# EAGLE design OMNIBUS GRBL board v2 (EAGLE 9.3.1)
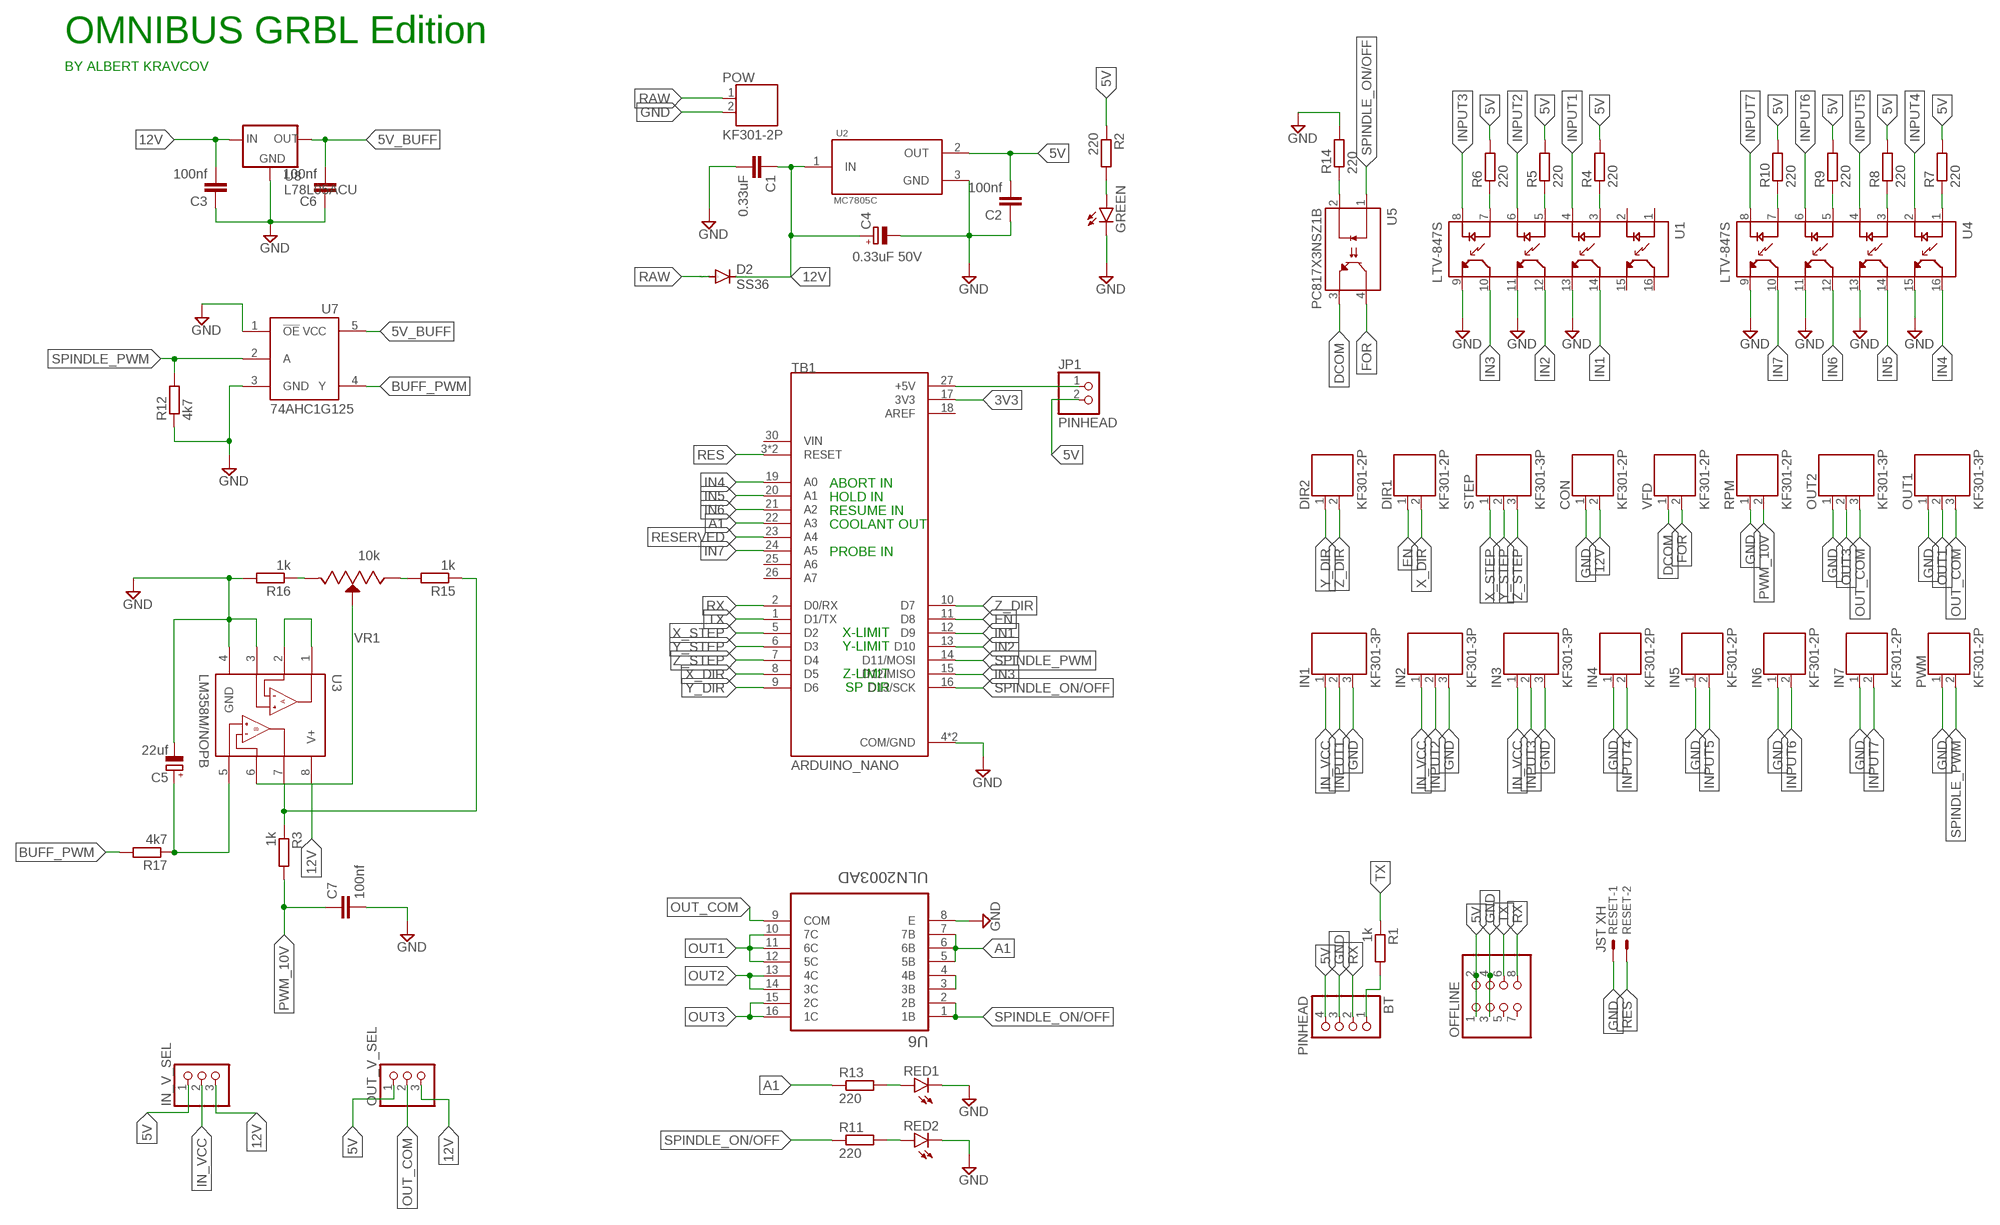
[diagram p0: schematic, sheet 1]

## Parts
BT  PINHEAD  PINHD-1X4  [1X04]
C1  0.33uF  C-EUC1206K  [C1206K]
C2  100nf  C-EUC0805K  [C0805K]
C3  100nf  C-EUC0805  [C0805]
C4  0.33uF 50V  CPOL-EUE2-5  [E2-5]
C5  22uf  CPOL-EUE2-5  [E2-5]
C6  100nf  C-EUC0805  [C0805]
C7  100nf  C-EUC0805  [C0805]
CON  KF301-2P  691131710002  [691131710002]
D2  SS36  ES2D  [SMB]
DIR1  KF301-2P  691131710002  [691131710002]
DIR2  KF301-2P  691131710002  [691131710002]
GREEN  LEDCHIPLED_0805  [CHIPLED_0805]
IN1  KF301-3P  691131710003  [691131710003]
IN2  KF301-3P  691131710003  [691131710003]
IN3  KF301-3P  691131710003  [691131710003]
IN4  KF301-2P  691131710002  [691131710002]
IN5  KF301-2P  691131710002  [691131710002]
IN6  KF301-2P  691131710002  [691131710002]
IN7  KF301-2P  691131710002  [691131710002]
IN_V_SEL  PINHD-1X3  [1X03]
JP1  PINHEAD  PINHD-1X2  [1X02]
OFFLINE  PINHD-2X4  [2X04]
OUT1  KF301-3P  691131710003  [691131710003]
OUT2  KF301-3P  691131710003  [691131710003]
OUT_V_SEL  PINHD-1X3  [1X03]
POW  KF301-2P  691131710002  [691131710002]
PWM  KF301-2P  691131710002  [691131710002]
R1  1k  R-EU_R0805  [R0805]
R2  220  R-EU_R0603  [R0603]
R3  1k  R-EU_R0805  [R0805]
R4  220  R-EU_R0805  [R0805]
R5  220  R-EU_R0805  [R0805]
R6  220  R-EU_R0805  [R0805]
R7  220  R-EU_R0805  [R0805]
R8  220  R-EU_R0805  [R0805]
R9  220  R-EU_R0805  [R0805]
R10  220  R-EU_R0805  [R0805]
R11  220  R-EU_R0603  [R0603]
R12  4k7  R-EU_R0805  [R0805]
R13  220  R-EU_R0603  [R0603]
R14  220  R-EU_R0805  [R0805]
R15  1k  R-EU_R0805  [R0805]
R16  1k  R-EU_R0805  [R0805]
R17  4k7  R-EU_R0805  [R0805]
RED1  LEDCHIPLED_0805  [CHIPLED_0805]
RED2  LEDCHIPLED_0805  [CHIPLED_0805]
RESET  JST XH  22-23-2021  [22-23-2021]
RPM  KF301-2P  691131710002  [691131710002]
STEP  KF301-3P  691131710003  [691131710003]
TB1  ARDUINO_NANO  [SHIELD_ARDUINO_NANO]
U1  LTV-847S  [SOIC254P1016X460-16N]
U2  MC7805C  L7805ACD2T-TR  [TO254P1515X470-3N]
U3  LM358M/NOPB  [SOIC127P599X175-8N]
U4  LTV-847S  [SOIC254P1016X460-16N]
U5  PC817X3NSZ1B  [DIP762W50P254L495H455Q4]
U6  ULN2003AD  [SOIC127P600X175-16N]
U7  74AHC1G125  [SOT23-5L]
U8  L78L05ACU  [SOT89]
VFD  KF301-2P  691131710002  [691131710002]
VR1  10k  3296W-1-502  [TRIM_3296W-1-502]

## Nets
3V3 [power]: TB1.17(3V3)
5V [power]: BT.4 C2.2 IN_V_SEL.1 JP1.2 OFFLINE.1 OFFLINE.2 OUT_V_SEL.1 R2.1 R4.2 R5.2 R6.2 R7.2 R8.2 R9.2 R10.2 U2.2(OUT)
5V_BUFF: C6.2 U7.5(VCC) U8.1(OUT)
12V [power]: C1.1 C3.2 C4.+ CON.2 D2.C IN_V_SEL.3 OUT_V_SEL.3 U2.1(IN) U3.8(V+) U8.3(IN)
A1 [sign]: R13.1 TB1.22(A3) U6.5(5B) U6.6(6B) U6.7(7B)
A2: U6.3(3B) U6.4(4B)
ARDUPWR [power]: JP1.1 TB1.27(+5V)
BUFF_PWM [sign]: R17.2 U7.4(Y)
DCOM [power]: U5.3(EMITTER) VFD.1
EN [power]: DIR1.1 TB1.11(D8)
FOR [power]: U5.4(COLLECTOR) VFD.2
GND: BT.3 C1.2 C2.1 C3.1 C4.- C5.- C6.1 C7.2 CON.1 GREEN.C IN1.3 IN2.3 IN3.3 IN4.1 IN5.1 IN6.1 IN7.1 OFFLINE.3 OFFLINE.4 OUT1.1 OUT2.1 POW.2 PWM.1 R12.1 R14.2 R16.2 RED1.C RED2.C RESET.1 RPM.1 TB1.4(COM/GND) TB1.29(COM/GND) U1.9(ET3) U1.11(ET2) U1.13(ET1) U2.3(GND) U3.3(+INA) U3.4(GND) U4.9(ET3) U4.11(ET2) U4.13(ET1) U4.15(ET) U6.8(E) U7.1(!OE) U7.3(GND) U8.2(GND)
IN1 [sign]: TB1.12(D9) U1.14(CT1)
IN2 [sign]: TB1.13(D10) U1.12(CT2)
IN3 [sign]: TB1.15(D12/MISO) U1.10(CT3)
IN4 [sign]: TB1.19(A0) U4.16(CT)
IN5 [sign]: TB1.20(A1) U4.14(CT1)
IN6 [sign]: TB1.21(A2) U4.12(CT2)
IN7 [sign]: TB1.24(A5) U4.10(CT3)
IN_VCC [power]: IN1.1 IN2.1 IN3.1 IN_V_SEL.2
INPUT1 [sign]: IN1.2 U1.4(C1)
INPUT2 [sign]: IN2.2 U1.6(C2)
INPUT3 [sign]: IN3.2 U1.8(C3)
INPUT4 [sign]: IN4.2 U4.2(C)
INPUT5 [power]: IN5.2 U4.4(C1)
INPUT6 [power]: IN6.2 U4.6(C2)
INPUT7 [power]: IN7.2 U4.8(C3)
N$1 [power]: GREEN.A R2.2
N$2 [sign]: R4.1 U1.3(A1)
N$3 [sign]: R5.1 U1.5(A2)
N$4 [sign]: R6.1 U1.7(A3)
N$6 [sign]: R7.1 U4.1(A)
N$7 [sign]: R8.1 U4.3(A1)
N$8 [sign]: R9.1 U4.5(A2)
N$9 [sign]: R10.1 U4.7(A3)
N$11: R11.2 RED2.A
N$12: R13.2 RED1.A
N$13 [sign]: R14.1 U5.2(CATHODE)
N$14 [sign]: U3.6(-INB) VR1.2(WIPER)
N$15 [sign]: R15.2 VR1.1(CCW)
N$16 [sign]: R16.1 VR1.3(CW)
N$17: C5.+ R17.1 U3.5(+INB)
N$18: U3.1(OUTA) U3.2(-INA)
N$19: BT.1 R1.2
OUT1 [sign]: OUT1.2 U6.10(7C) U6.11(6C) U6.12(5C)
OUT2: U6.13(4C) U6.14(3C)
OUT3 [sign]: OUT2.2 U6.15(2C) U6.16(1C)
OUT_COM [power]: OUT1.3 OUT2.3 OUT_V_SEL.2 U6.9(COM)
PWM_10V [sign]: C7.1 R3.1 R3.2 R15.1 RPM.2 U3.7(OUTB)
RAW [power]: D2.A POW.1
RES: RESET.2 TB1.3(RESET) TB1.28(RESET)
RESERVED: TB1.23(A4)
RX [sign]: BT.2 OFFLINE.8 TB1.2(D0/RX)
SPINDLE_ON/OFF [sign]: R11.1 TB1.16(D13/SCK) U5.1(ANODE) U6.1(1B) U6.2(2B)
SPINDLE_PWM [sign]: PWM.2 R12.2 TB1.14(D11/MOSI) U7.2(A)
TX: OFFLINE.6 R1.1 TB1.1(D1/TX)
X_DIR [sign]: DIR1.2 TB1.8(D5)
X_STEP [sign]: STEP.1 TB1.5(D2)
Y_DIR [sign]: DIR2.1 TB1.9(D6)
Y_STEP [sign]: STEP.2 TB1.6(D3)
Z_DIR [sign]: DIR2.2 TB1.10(D7)
Z_STEP [sign]: STEP.3 TB1.7(D4)
Unconnected: OFFLINE.5 OFFLINE.7 TB1.25(A6) TB1.26(A7) TB1.30(VIN) U1.1(A) U1.2(C) U1.15(ET) U1.16(CT)

## Notes on the sheet
- OMNIBUS GRBL Edition
- BY ALBERT KRAVCOV
- ABORT IN
- HOLD IN
- RESUME IN
- COOLANT OUT
- PROBE IN
- X-LIMIT
- Y-LIMIT
- Z-LIMIT
- SP DIR

## Power pins joined to a net without a drawn wire
AREF: TB1.18(AREF)

## Library data of the parts
BT = pinhead:PINHD-1X4: PIN HEADER
C1-C3 C6 C7 = rcl:C-EU: CAPACITOR, European symbol; SPICEPREFIX: C
C4 C5 = rcl:CPOL-EU: POLARIZED CAPACITOR, European symbol; SPICEPREFIX: C
CON DIR1 DIR2 IN4-IN7 POW PWM RPM VFD = Wurth_Terminal_Blocks_Connectors_rev15d:691131710002: WR-TBL Terminal block - CUU5/2 CUU5/2GR - 2 Pins;=>Code : Con_TBL_Screw_PClamp_5.00_6911317100xx_691131710002 <http://katalog.we-online.de/media/images/eican/Con_TBL_Screw_PClamp_5.00_6911317100xx_pf2.jpg> Details see: http://katalog.we-online.de/em/datasheet/6911317100xx.pdf Created 11/23/2014, Karrer Zheng 2014 (C) Wurth Elektronik
D2 = diode:ES2D: DIODE super fast rectifier, 2 A
GREEN RED1 RED2 = led:LED: LED OSRAM: - CHIPLED LG R971, LG N971, LY N971, LG Q971, LY Q971, LO R971, LY R971 LH N974, LH R974 LS Q976, LO Q976, LY Q976 LO Q996 - Hyper CHIPLED LW Q18S LB Q993, LB Q99A, LB R99A - SideLED LS A670, LO A670, LY A670, LG A670, LP A670 LB A673, LV A673, LT A673, LW A673 LH A674 LY A675 LS A676, LA A676, LO A676, LY A676, LW A676 LS A679, LY A679, LG A679 - Hyper Micro SIDELED® LS Y876, LA Y876, LO Y876, LY Y876 LT Y87S - SmartLED LW L88C, LW L88S LB L89C, LB L89S, LG L890 LS L89K, LO L89K, LY L89K LS L896, LA L896, LO L896, LY L896 - TOPLED LS T670, LO T670, LY T670, LG T670, LP T670 LSG T670, LSP T670, LSY T670, LOP T670, LYG T670 LG T671, LOG T671, LSG T671 LB T673, LV T673, LT T673, LW T673 LH T674 LS T676, LA T676, LO T676, LY T676, LB T676, LH T676, LSB T676, LW T676 LB T67C, LV T67C, LT T67C, LS T67K, LO T67K, LY T67K, LW E67C LS E67B, LA E67B, LO E67B, LY E67B, LB E67C, LV E67C, LT E67C LW T67C LS T679, LY T679, LG T679 LS T770, LO T770, LY T770, LG T770, LP T770 LB T773, LV T773, LT T773, LW T773 LH T774 LS E675, LA E675, LY E675, LS T675 LS T776, LA T776, LO T776, LY T776, LB T776 LHGB T686 LT T68C, LB T68C - Hyper Mini TOPLED® LB M676 - Mini TOPLED Santana® LG M470 LS M47K, LO M47K, LY M47K Source: http://www.osram.convergy.de LUXEON: - LUMILED® LXK2-PW12-R00, LXK2-PW12-S00, LXK2-PW14-U00, LXK2-PW14-V00 LXK2-PM12-R00, LXK2-PM12-S00, LXK2-PM14-U00 LXK2-PE12-Q00, LXK2-PE12-R00, LXK2-PE12-S00, LXK2-PE14-T00, LXK2-PE14-U00 LXK2-PB12-K00, LXK2-PB12-L00, LXK2-PB12-M00, LXK2-PB14-N00, LXK2-PB14-P00, LXK2-PB14-Q00 LXK2-PR12-L00, LXK2-PR12-M00, LXK2-PR14-Q00, LXK2-PR14-R00 LXK2-PD12-Q00, LXK2-PD12-R00, LXK2-PD12-S00 LXK2-PH12-R00, LXK2-PH12-S00 LXK2-PL12-P00, LXK2-PL12-Q00, LXK2-PL12-R00 Source: www.luxeon.com KINGBRIGHT: KA-3528ASYC Source: www.kingbright.com
IN1-IN3 OUT1 OUT2 STEP = Wurth_Terminal_Blocks_Connectors_rev15d:691131710003: WR-TBL Terminal block - CUU5/3 - 3 Pins;=>Code : Con_TBL_Screw_PClamp_5.00_6911317100xx_691131710003 <http://katalog.we-online.de/media/images/eican/Con_TBL_Screw_PClamp_5.00_6911317100xx_pf2.jpg> Details see: http://katalog.we-online.de/em/datasheet/6911317100xx.pdf Created 11/3/2014, Karrer Zheng 2014 (C) Wurth Elektronik
IN_V_SEL OUT_V_SEL = pinhead:PINHD-1X3: PIN HEADER
JP1 = pinhead:PINHD-1X2: PIN HEADER
OFFLINE = pinhead:PINHD-2X4: PIN HEADER
R1-R17 = rcl:R-EU_: RESISTOR, European symbol; SPICEPREFIX: R
RESET = con-molex:22-23-2021: .100" (2.54mm) Center Header - 2 Pin; MF: MOLEX; MPN: 22-23-2021; OC_FARNELL: 1462926; OC_NEWARK: 25C3832
TB1 = ARDUINO_NANO-2:ARDUINO_NANO: Arduino Nano, Through Hole; AVAILABILITY: Unavailable; DESCRIPTION: ATmega4809 Arduino Nano Every with Headers AVR® AVR MCU 8-Bit Embedded Evaluation Board; MF: Arduino; MP: ARDUINO NANO; PACKAGE: None; PRICE: None
U1 U4 = LTV-847S:LTV-847S: Optocoupler DC-IN 4-CH Transistor DC-OUT 16-Pin PDIP SMD Check prices <https://pricing.snapeda.com/parts/LTV-847S/Lite-On%20Inc./view-part?ref=eda>; AVAILABILITY: Bad; DESCRIPTION: Optoisolator Transistor Output 5000Vrms 4 Channel 16-SMD; MF: Lite-On Inc.; MP: LTV-847S; PACKAGE: SMD-16 Lite-On; PRICE: None; PURCHASE-URL: https://pricing.snapeda.com/search/part/LTV-847S/?ref=eda
U2 = L7805ACD2T-TR:L7805ACD2T-TR: Positive voltage regulator ICs Check prices <https://pricing.snapeda.com/parts/L7805ACD2T-TR/STMicroelectronics/view-part?ref=eda>; AVAILABILITY: Good; DESCRIPTION: Linear Voltage Regulator IC Positive Fixed 1 Output 1.5A D2PAK; MF: STMicroelectronics; MP: L7805ACD2T-TR; PACKAGE: D2PAK STMicroelectronics; PRICE: None; PURCHASE-URL: https://pricing.snapeda.com/search/part/L7805ACD2T-TR/?ref=eda
U3 = LM358M_NOPB:LM358M/NOPB: Check prices <https://snapeda.com/parts/LM358M/NOPB/NOPB/Texas%20Instruments/view-part/?ref=eda> Check prices <https://pricing.snapeda.com/parts/LM358M/Texas%20Instruments/view-part?ref=eda>; AVAILABILITY: Warning; DESCRIPTION: 2-Channel, 1MHz, industry standard, 32V op amp 8-SOIC 0 to 70; MF: Texas Instruments; MP: LM358M; PACKAGE: SOIC-8 Texas Instruments; PRICE: None; PURCHASE-URL: https://pricing.snapeda.com/search/part/LM358M/?ref=eda
U5 = PC817X3NSZ1B:PC817X3NSZ1B: Optoisolator Transistor Output 1 Channel 4-DIP Check prices <https://pricing.snapeda.com/parts/PC817X3NSZ1B/Sharp%20Microelectronics/view-part?ref=eda>; AVAILABILITY: Bad; DESCRIPTION: Optoisolator Transistor Output 1 Channel 4-DIP; MF: Sharp Microelectronics; MP: PC817X3NSZ1B; PACKAGE: None; PRICE: None; PURCHASE-URL: https://pricing.snapeda.com/search/part/PC817X3NSZ1B/?ref=eda
U6 = ULN2003AD:ULN2003AD: Check prices <https://pricing.snapeda.com/parts/ULN2003AD/Texas%20Instruments/view-part?ref=eda>; AVAILABILITY: Warning; DESCRIPTION: 50-V, 7-ch darlington transistor array, -20C to 70C 16-SOIC -40 to 70; MF: Texas Instruments; MP: ULN2003AD; PACKAGE: SOIC-16 Texas Instruments; PRICE: None; PURCHASE-URL: https://pricing.snapeda.com/search/part/ULN2003AD/?ref=eda
U7 = 74AHC1G125:74AHC1G125; AVAILABILITY: Unavailable; DESCRIPTION: Buffer, Non-Inverting 1 Element 1 Bit per Element 3-State Output SOT-23-5; MF: Texas Instruments; MP: 74AHC1G125; PACKAGE: SOT-23 Texas Instruments; PRICE: None
U8 = L78L05ACU:L78L05ACU: 5V Positive voltage regulator SMD SOT89 Package; AVAILABILITY: Unavailable; DESCRIPTION: Linear Voltage Regulator IC Positive Fixed 1 Output 100mA SOT-89-3; MF: STMicroelectronics; MP: L78L05ACU; PACKAGE: SOT-89-3 STMicroelectronics; PRICE: None
VR1 = 3296W-1-502:3296W-1-502: Res Cermet Trimmer 500K Ohm 10% 0.5W 25(Elec)Turn 2.19mm (9.53 X 4.83 X 11.55mm) Pin Thru-Hole Tube Check prices <https://pricing.snapeda.com/parts/3296W-1-502/Bourns/view-part?ref=eda>; AVAILABILITY: Warning; DESCRIPTION: 5 kOhms 0.5W, 1/2W PC Pins Through Hole Trimmer Potentiometer Cermet 25 Turn Top Adjustment; MF: Bourns; MP: 3296W-1-502; PACKAGE: SOT-23-5 Bourns; PRICE: None; PURCHASE-URL: https://pricing.snapeda.com/search/part/3296W-1-502/?ref=eda

## Net classes
0 default: width 0.305 mm, drill 0.305 mm, clearance 0.305 mm
1 power: width 0.635 mm, drill 0.635 mm, clearance 0.635 mm
2 sign: width 0.508 mm, drill 0.508 mm, clearance 0.508 mm

## Board
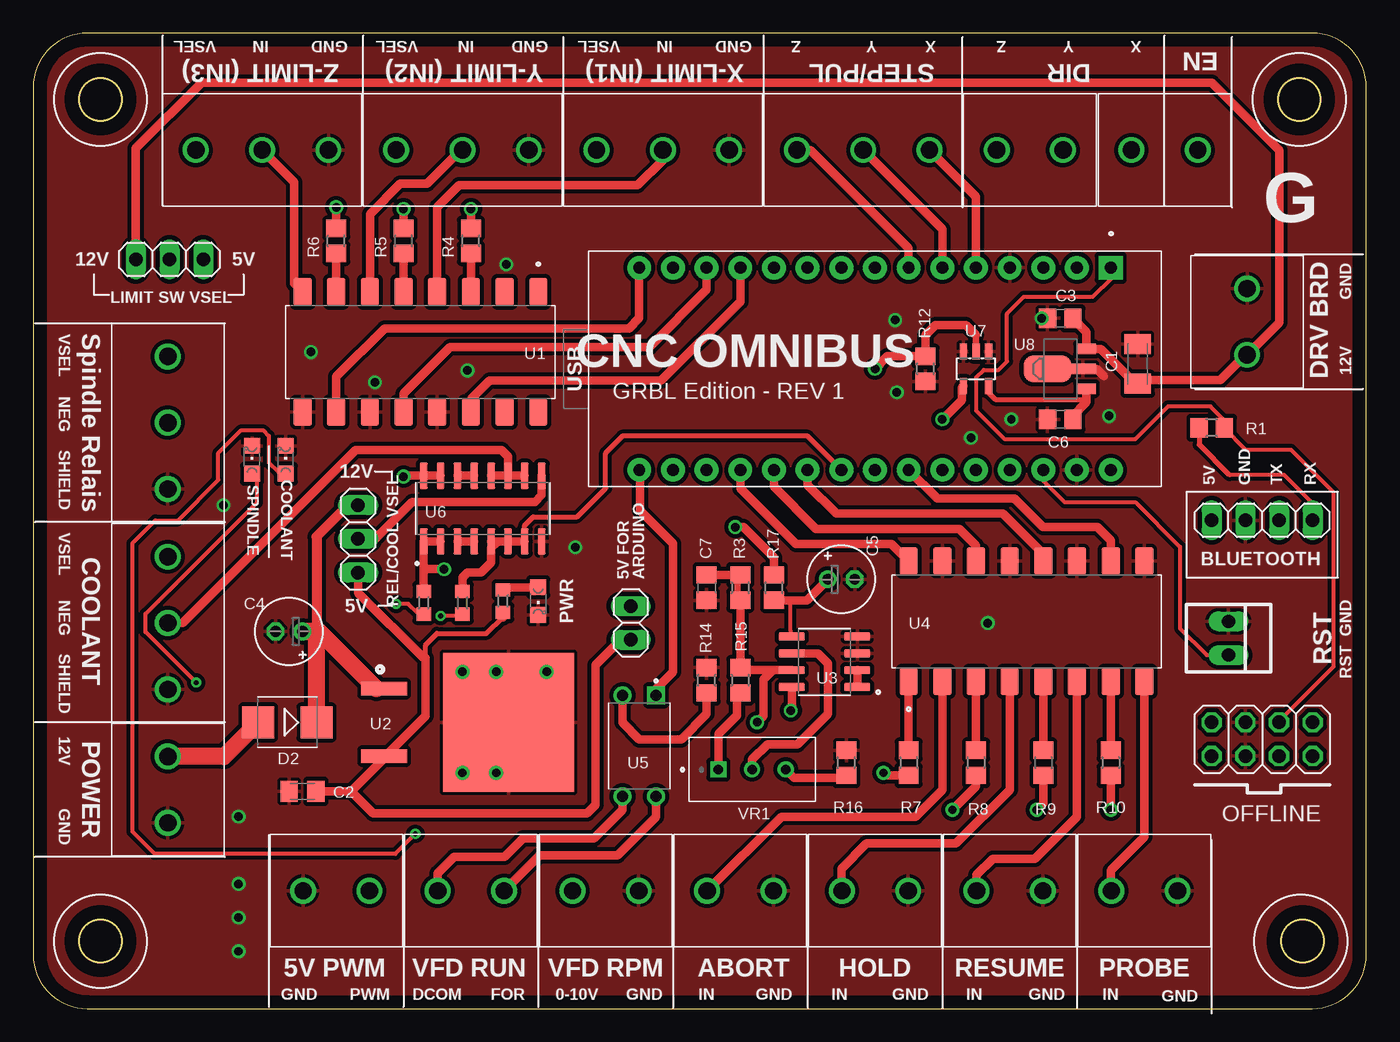
[diagram p1: board, top side]
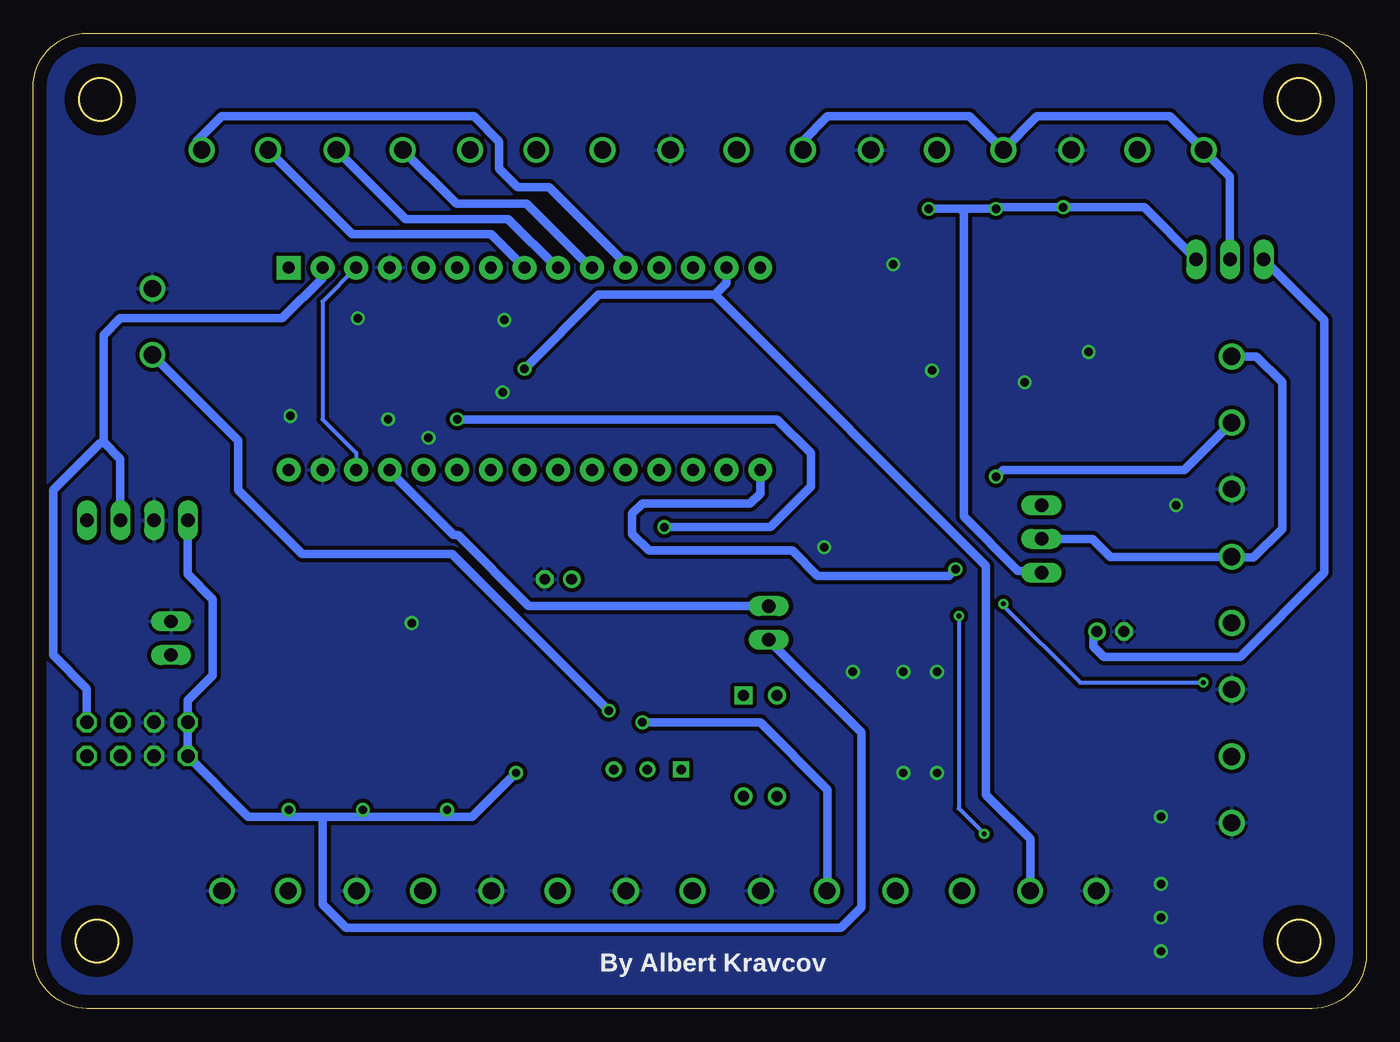
[diagram p2: board, bottom side, seen from below]

Size 100.56 x 73.58 mm. Coordinates in mm from the lower left corner, seen from the top.
Outline: 0,69.52 0,4.06 arc90 4.06,0 96.5,0 arc90 100.56,4.06 100.56,69.52 arc90 96.5,73.58 4.06,73.58 arc90 0,69.52
Outline: circle at 5.08,5.08 radius 1.6
Outline: circle at 95.76,5.08 radius 1.6
Outline: circle at 5.08,68.58 radius 1.6
Outline: circle at 95.5,68.58 radius 1.6
Copper layers (1*16): Top 0.035mm / dielectric 1.5mm / Bottom 0.035mm
Design rules "default *": minimum track width 6mil, minimum drill 0.35mm, track to track 6mil, track to pad 6mil, pad to pad 6mil, via to via 6mil, smd to smd 6mil, copper to edge 40mil, drill to drill 6mil, minimum pad ring 10mil, minimum via ring 8mil, stop-mask expansion 4mil, vias tented up to drill 2mm, thermal gap 10mil

### Footprints (pad centres in the part's own frame; a part is rotated, then mirrored left to right if it is on the bottom)
1X04 = drill 1.016 long: 1 -3.81,0; 2 -1.27,0; 3 1.27,0; 4 3.81,0
C1206K = smd 1.5 x 2: 1 -1.5,0; 2 1.5,0
C0805K = smd 1.3 x 1.6: 1 -1,0; 2 1,0
C0805 = smd 1.3 x 1.5: 1 -0.95,0; 2 0.95,0
E2-5 = drill 0.813 pad 1.27: + -1.016,0 | drill 0.813 pad 1.27 octagon: - 1.016,0
691131710002 = drill 1.3: 1 -2.5,0; 2 2.5,0
SMB = smd 2.4 x 2.4: A 2.2,0; C -2.2,0
CHIPLED_0805 = smd 1.2 x 1.2: A 0,-1.05; C 0,1.05
691131710003 = drill 1.3: 1 -5,0; 2 0,0; 3 5,0
1X03 = drill 1.016 long: 1 -2.54,0; 2 0,0; 3 2.54,0
1X02 = drill 1.016 long: 1 -1.27,0; 2 1.27,0
2X04 = drill 1.016 octagon: 1 -3.81,-1.27; 2 -3.81,1.27; 3 -1.27,-1.27; 4 -1.27,1.27; 5 1.27,-1.27; 6 1.27,1.27; 7 3.81,-1.27; 8 3.81,1.27
R0805 = smd 1.3 x 1.5: 1 -0.95,0; 2 0.95,0
R0603 = smd 1 x 1.1: 1 -0.85,0; 2 0.85,0
22-23-2021 = drill 1 long: 1 -1.27,0; 2 1.27,0
SHIELD_ARDUINO_NANO = drill 0.9 pad 1.8 square: 1 -7.62,17.78 | drill 0.9 pad 1.8: 2 -7.62,15.24; 3 -7.62,12.7; 4 -7.62,10.16; 5 -7.62,7.62; 6 -7.62,5.08; 7 -7.62,2.54; 8 -7.62,0; 9 -7.62,-2.54; 10 -7.62,-5.08; 11 -7.62,-7.62; 12 -7.62,-10.16; 13 -7.62,-12.7; 14 -7.62,-15.24; 15 -7.62,-17.78; 16 7.62,-17.78; 17 7.62,-15.24; 18 7.62,-12.7; 19 7.62,-10.16; 20 7.62,-7.62; 21 7.62,-5.08; 22 7.62,-2.54; 23 7.62,0; 24 7.62,2.54; 25 7.62,5.08; 26 7.62,7.62; 27 7.62,10.16; 28 7.62,12.7; 29 7.62,15.24; 30 7.62,17.78
SOIC254P1016X460-16N = smd 2.09 x 1.39: 1 -4.54,8.89; 2 -4.54,6.35; 3 -4.54,3.81; 4 -4.54,1.27; 5 -4.54,-1.27; 6 -4.54,-3.81; 7 -4.54,-6.35; 8 -4.54,-8.89; 9 4.54,-8.89; 10 4.54,-6.35; 11 4.54,-3.81; 12 4.54,-1.27; 13 4.54,1.27; 14 4.54,3.81; 15 4.54,6.35; 16 4.54,8.89
TO254P1515X470-3N = smd 3.45 x 1: 1 -6.3,2.54; 2 -6.3,-2.54 | smd 9.85 x 10.5: 3 3.1,0
SOIC127P599X175-8N = smd 1.97 x 0.6: 1 -2.47,1.905; 2 -2.47,0.635; 3 -2.47,-0.635; 4 -2.47,-1.905; 5 2.47,-1.905; 6 2.47,-0.635; 7 2.47,0.635; 8 2.47,1.905
DIP762W50P254L495H455Q4 = drill 0.84 pad 1.26 square: 1 -3.81,1.27 | drill 0.84 pad 1.26: 2 -3.81,-1.27; 3 3.81,-1.27; 4 3.81,1.27
SOIC127P600X175-16N = smd 1.97 x 0.6: 1 -2.475,4.445; 2 -2.475,3.175; 3 -2.475,1.905; 4 -2.475,0.635; 5 -2.475,-0.635; 6 -2.475,-1.905; 7 -2.475,-3.175; 8 -2.475,-4.445; 9 2.475,-4.445; 10 2.475,-3.175; 11 2.475,-1.905; 12 2.475,-0.635; 13 2.475,0.635; 14 2.475,1.905; 15 2.475,3.175; 16 2.475,4.445
SOT23-5L = smd 0.55 x 1.2: 1 -0.95,-1.3; 2 0,-1.3; 3 0.95,-1.3; 4 0.95,1.3; 5 -0.95,1.3
SOT89 = smd 0.8 x 1.4: 1 -1.499,-1.981; 3 1.499,-1.981 | smd 0.8 x 1.9: 2 0,-1.727 | smd 2.032 x 3.65: 2@1 0,0.94
TRIM_3296W-1-502 = drill 0.71 square: 1 -2.54,0 | drill 0.71: 2 0,0; 3 2.54,0

### Placement (x,y rotation side)
BT  92.71,36.83 180 top
C1  83.31,48.64 90 top
C2  20.32,16.38 0 top
C3  77.47,52.07 0 top
C4  19.3,28.45 180 top
C5  60.96,32.38 0 top
C6  77.47,44.45 0 top
C7  50.8,31.75 270 top
CON  91.57,51.82 270 top
D2  19.18,21.59 180 top
DIR1  85.34,64.77 180 top
DIR2  75.18,64.77 180 top
GREEN  38.1,30.73 180 top
IN1  47.5,64.77 0 top
IN2  32.38,64.77 0 top
IN3  17.27,64.77 0 top
IN4  53.34,8.89 180 top
IN5  63.5,8.89 180 top
IN6  73.66,8.89 180 top
IN7  83.82,8.89 180 top
IN_V_SEL  10.29,56.52 180 top
JP1  45.09,29.08 270 top
OFFLINE  92.71,20.32 0 top
OUT1  10.16,29.08 90 top
OUT2  10.16,44.2 90 top
OUT_V_SEL  24.51,35.43 90 top
POW  10.16,16.51 270 top
PWM  22.86,8.89 0 top
R1  88.9,43.82 180 top
R2  35.43,30.73 90 top
R3  53.34,31.75 270 top
R4  33.02,57.91 90 top
R5  27.94,57.91 90 top
R6  22.86,57.91 90 top
R7  66.04,18.54 270 top
R8  71.12,18.54 270 top
R9  76.2,18.54 270 top
R10  81.28,18.54 270 top
R11  29.46,30.61 270 top
R12  67.31,48.26 90 top
R13  32.38,30.61 270 top
R14  50.8,24.77 90 top
R15  53.34,24.77 270 top
R16  61.34,18.54 90 top
R17  55.88,31.75 90 top
RED1  19.05,41.4 0 top
RED2  16.51,41.4 0 top
RESET  90.17,27.94 270 top
RPM  43.18,8.89 180 top
STEP  62.61,64.77 180 top
TB1  63.5,48.26 270 top
U1  29.21,49.53 270 top
U2  32.77,21.59 0 top
U3  59.69,26.16 180 top
U4  74.93,29.21 90 top
U5  45.72,19.81 270 top
U6  33.91,37.72 90 top
U7  71.12,48.26 180 top
U8  77.47,48.26 90 top
VFD  33.02,8.89 0 top
VR1  54.23,18.03 0 top

### Tracks (layer width: path | path; a pad name or v marks a point on that pad's centre or on a via)
5V  (via drill 0.64)
  Top 0.381: 35.43,29.52 34.22,28.3 30.46,28.3 29.61,27.45 29.61,26.43
  Top 0.635: v69.34,14.99 71.12,16.76 R8.2 | v64.14,17.78 64.32,17.59 R7.2 | v75.69,14.99 76.2,15.49 R9.2 | v81.28,14.99 R10.2 | v22.86,60.45 R6.2 | R5.2 v27.94,60.33 | R4.2 v33.02,60.33 | 23.99,16.38 26.47,18.86 U2.2 26.59,19.05 29.61,22.06 29.61,26.43 29.45,26.43 24.51,31.37 OUT_V_SEL.1 | C2.2 23.99,16.38 | JP1.2 44.32,27.81 42.42,25.91 42.42,15.37 41.78,14.73 25.64,14.73 23.99,16.38 | R2.1 35.43,29.52
  Bottom 0.635: v64.14,17.78 67.44,14.48 69.34,14.48 | 69.34,14.48 75.69,14.48 | 75.69,14.48 78.61,14.48 | 78.61,14.48 81.28,14.48 | 81.28,14.48 84.33,14.48 OFFLINE.1 OFFLINE.2 88.9,23.24 87.01,25.13 87.01,30.88 88.9,32.77 BT.4 | v69.34,14.99 69.34,14.48 | v75.69,14.99 75.69,14.48 | v81.28,14.99 81.28,14.48 | IN_V_SEL.1 16.76,60.45 v22.86,60.45 27.81,60.45 v27.94,60.33 30.61,60.33 | 30.61,60.33 v33.02,60.33 | 30.61,60.33 30.35,60.07 30.35,37.1 26.27,33.02 24.64,33.02 OUT_V_SEL.1 | JP1.2 38.1,20.83 38.1,7.62 39.62,6.1 76.96,6.1 78.74,7.87 78.74,14.35 78.61,14.48
5V_BUFF
  Top 0.305: 79.42,45.7 79.35,45.77 79.35,45.95
  Top 0.381: U7.5 72.07,46.45 72.57,45.95 79.35,45.95 79.45,45.95
  Top 0.635: U8.1 79.45,45.95 | 79.45,45.74 79.42,45.7 78.42,44.7 C6.2
12V  (via drill 0.64)
  Top 0.635: U3.8 57.22,22.55 v57.15,22.48 | C3.2 79.45,51.04 U8.3 79.47,49.74 80.54,49.74 82.78,47.5 82.8,47.5 83.16,47.14 C1.1 83.57,47.4 89.54,47.4 91.46,49.32 CON.2 93.98,51.73 93.98,64.77 88.9,69.85 12.7,69.85 7.75,64.9 IN_V_SEL.3 | OUT_V_SEL.3 23.75,37.97
  Top 0.762: U2.1 25.91,24.13 | 21.38,26.96 21.38,35.6 23.75,37.97
  Top 1.27: D2.C 21.38,26.96 21.38,28.41 21.34,28.45 C4.+ 21.59,28.45 25.91,24.13
  Bottom 0.635: IN_V_SEL.3 3.17,51.94 3.17,32.89 9.53,26.54 19.81,26.54 20.57,27.3 20.57,28.19 C4.+ | CON.2 85.09,42.84 85.09,39.12 80.26,34.29 68.96,34.29 v57.15,22.48
A1
  Top 0.381: TB1.22 58.42,43.18 44.45,43.18 43.18,41.91 43.18,39.24 41.02,37.08 37.72,37.08 37.08,36.45 U6.7
  Top 0.635: U6.7 U6.6 | U6.6 U6.5 | R13.1 32.38,32.51 32.77,32.89 33.78,32.89 34.54,33.66 34.54,34.74 35.05,35.24 U6.6
A2
  Top 0.635: U6.4 U6.3
ARDUPWR
  Bottom 0.635: JP1.1 45.19,30.38 63.2,30.38 68.53,35.71 68.83,35.71 73.71,40.59 TB1.27
BUFF_PWM  (via drill 0.64)
  Top 0.635: R17.2 55.88,34.04 53.59,36.32 v52.96,36.32 | v68.58,44.45 70.04,45.91 70.04,46.83 U7.4
  Bottom 0.635: v52.96,36.32 44.96,36.32 41.91,39.37 41.91,41.91 44.45,44.45 v68.58,44.45
DCOM
  Top 0.635: U5.3 44.45,14.99 42.29,12.83 36.96,12.83 35.56,11.43 31.75,11.43 30.52,10.2 VFD.1
EN
  Bottom 0.635: TB1.11 55.88,56.21 61.64,61.98 64.01,61.98 65.41,63.37 65.41,65.41 67.31,67.31 86.36,67.31 88.27,65.41 88.27,65.19 DIR1.1
FOR
  Top 0.635: U5.4 46.99,14.48 44.07,11.56 38.19,11.56 VFD.2
GND  (via drill 0.64)
  Top 0.635: U8.2 80.23,48.26 80.75,47.73
  other vias: 32.77,48.13 20.95,49.53 35.69,56.13 40.89,34.8 32.38,25.4 32.38,17.78 34.92,17.78 34.92,25.4 38.73,25.4 65.02,51.94 81.15,44.7 73.79,44.45 70.74,43.05 65.15,46.48 72.01,29.08 14.35,37.97 76.07,52.07 15.49,14.48 15.49,9.4 15.49,6.86 15.49,4.32 25.78,47.24
  pour Top: -1.27,73.66 -1.27,-0.86 arc45 -0.08,-3.73 0,-3.81 101.6,-3.81 101.6,69.44 arc45 100.41,72.31 99.06,73.66
  pour Bottom: -3.81,77.47 -3.81,-5.08 101.19,-5.08 arc-45 104.06,-6.27 104.14,-6.35 104.14,71.98 arc45 102.95,74.85 100.33,77.47
IN1
  Top 0.635: U1.14 33.02,45.97 34.42,47.37 47.37,47.37 53.34,53.34 TB1.12
IN2
  Top 0.635: TB1.13 50.8,54.23 46.48,49.91 31.45,49.91 27.94,46.4 U1.12
IN3
  Top 0.635: U1.10 22.86,47.67 26.5,51.31 44.96,51.31 45.72,52.07 TB1.15
IN4
  Top 0.635: U4.16 64.74,35.05 57.53,35.05 53.34,39.24 TB1.19
IN5
  Top 0.635: TB1.20 55.88,39.37 59.05,36.2 69.85,36.2 71.12,34.93 U4.14
IN6
  Top 0.635: TB1.21 58.42,39.5 60.58,37.34 73.15,37.34 76.2,34.29 U4.12
IN7
  Top 0.635: TB1.24 68.2,38.48 74.01,38.48 76.17,36.32 80.26,36.32 81.28,35.31 U4.10
IN_VCC
  Bottom 0.635: IN_V_SEL.2 10.29,62.74 12.27,64.72 IN3.1 14.81,67.31 24.84,67.31 IN2.1 29.93,67.31 40.64,67.31 42.5,65.45 IN1.1
INPUT1
  Top 0.635: U1.4 30.48,60.45 32.13,62.1 45.59,62.1 47.5,64.01 IN1.2
INPUT2
  Top 0.635: U1.6 25.4,59.94 27.69,62.23 29.72,62.23 32.26,64.77 IN2.2
INPUT3
  Top 0.635: U1.8 19.68,54.71 19.68,62.36 IN3.2
INPUT4
  Top 0.635: IN4.2 56.43,14.48 66.55,14.48 68.58,16.51 U4.2
INPUT5
  Top 0.635: U4.4 73.66,16.51 69.6,12.45 62.87,12.45 60.96,10.54 60.96,8.93 IN5.2
INPUT6
  Top 0.635: IN6.2 71.16,10.07 72.39,11.3 75.57,11.3 78.74,14.48 U4.6
INPUT7
  Top 0.635: U4.8 83.82,12.95 81.28,10.41 81.28,8.93 IN7.2
N$1
  Top 0.635: GREEN.A 35.63,31.78 R2.2
N$2
  Top 0.635: R4.1 U1.3
N$3
  Top 0.635: U1.5 R5.1
N$4
  Top 0.635: U1.7 R6.1
N$6
  Top 0.635: U4.1 R7.1
N$7
  Top 0.635: U4.3 R8.1
N$8
  Top 0.635: R9.1 U4.5
N$9
  Top 0.635: R10.1 U4.7
N$11  (via drill 0.35)
  Top 0.305: v12.29,24.59 8.48,28.4 8.48,29.77 16.87,38.15 16.87,40.28 16.58,40.28 RED2.A | v27.38,30.53 28.3,30.53 29.06,29.77 29.36,29.77 R11.2
  Bottom 0.305: v12.29,24.59 21.59,24.59 27.38,30.38 v27.38,30.53
N$12  (via drill 0.35)
  Top 0.305: v28.83,13.18 27.3,11.66 9.17,11.66 7.49,13.33 7.49,35.1 9.22,36.83 10.92,36.83 13.97,39.88 13.97,41.91 15.7,43.64 17.35,43.64 17.78,43.21 17.78,41.2 18.54,40.44 18.96,40.44 RED1.A | v30.73,29.62 32.33,29.62 R13.2
  Bottom 0.305: v28.83,13.18 30.73,15.09 v30.73,29.62
N$13
  Top 0.635: U5.2 44.45,21.59 45.72,20.32 48.89,20.32 50.8,22.22 R14.1
N$14
  Top 0.635: VR1.2 54.23,18.8 55.37,19.94 57.66,19.94 59.94,22.22 59.94,26.04 59.18,26.8 U3.6
N$15
  Top 0.635: R15.2 53.09,23.56 53.09,22.1 51.69,20.7 VR1.1
N$16
  Top 0.635: VR1.3 57.4,17.4 61.15,17.4 R16.1
N$17
  Top 0.305: 57.1,30.8 57.1,28.56 U3.5
  Top 0.635: R17.1 57.1,30.8 58.36,30.8 C5.+
N$18
  Top 0.635: U3.1 U3.2
N$19
  Top 0.305: BT.1 96.52,38.1 94.36,40.26 90.24,40.26
  Top 0.381: 90.24,40.26 87.95,42.55 R1.2
OUT1
  Top 0.635: U6.12 U6.11 | U6.11 U6.10 | OUT1.2 11.29,29.08 24.34,42.13 35.34,42.13 35.81,41.66 U6.11
OUT2
  Top 0.635: U6.14 U6.13
OUT3  (via drill 0.64)
  Top 0.635: U6.15 U6.16 28,40.19 v27.94,40.13
  Bottom 0.635: OUT2.2 13.72,40.64 27.43,40.64 v27.94,40.13
OUT_COM
  Top 0.635: OUT_V_SEL.2 25.78,35.43 28.57,38.23 37.85,38.23 38.35,38.74 U6.9
  Bottom 0.635: OUT_V_SEL.2 20.65,35.43 19.3,34.08 OUT1.3 10.11,34.04 8.51,34.04 6.35,36.2 6.35,47.24 8.3,49.2 OUT2.3
PWM_10V  (via drill 0.64)
  Top 0.508: R3.1 53.14,32.51 53.14,30.99 R3.2
  Top 0.635: R3.2 R15.1 53.53,25.53 55.88,25.53 | 55.88,25.53 U3.7 | R3.1 C7.1 | 55.88,25.53 55.86,25.51 55.76,25.51 55.09,24.84 55.09,22.07 v54.61,21.59
  Bottom 0.635: RPM.2 40.64,8.93 40.64,16.51 45.72,21.59 v54.61,21.59
RAW
  Top 1.27: D2.A 14.4,19.01 POW.1
RES
  Top 0.305: RESET.2 88.52,26.67 86.51,28.68 86.51,34.82 83.13,38.2 77.8,38.2 76.2,39.8 TB1.28
  Bottom 0.305: TB1.3 78.74,53.34 78.74,44.45 76.2,41.91 TB1.28
RX
  Bottom 0.635: 95.25,42.73 93.98,41.46 BT.2 | 95.25,42.73 95.25,42.67 95.5,42.67 99.06,39.12 99.06,26.67 96.52,24.13 OFFLINE.8 | 95.25,42.73 95.25,50.8 93.98,52.07 81.78,52.07 78.74,55.11 TB1.2
SPINDLE_ON/OFF  (via drill 0.64)
  Top 0.635: TB1.16 45.77,40.59 45.77,37.59 48.26,35.1 48.26,25.4 46.99,24.13 U5.1 | U6.2 U6.1 29.46,33.02 | 29.46,33.02 R11.1 | v30.99,33.15 29.59,33.15 29.46,33.02
  Bottom 0.635: v30.99,33.15 31.5,32.64 41.4,32.64 43.31,34.54 54.1,34.54 55.37,35.81 55.37,37.34 54.61,38.1 46.48,38.1 45.72,38.86 TB1.16
SPINDLE_PWM  (via drill 0.64)
  Top 0.508: U7.2 71.12,50.8
  Top 0.635: 71.12,50.8 70.36,51.56 68.07,51.56 67.31,50.8 R12.2 64.45,49.21 v63.5,48.26
  Bottom 0.635: 49.15,53.85 48.26,54.74 TB1.14 | 49.15,53.85 28.7,33.4 28.7,16.13 25.36,12.79 PWM.2 | 49.15,53.85 57.91,53.85 v63.5,48.26
TX
  Top 0.305: OFFLINE.6 93.98,21.69 98.1,25.81 98.1,38.94 94.89,42.14 91.49,42.14 89.85,43.78 R1.1 89.71,43.94 89.71,44.5 88.8,45.42 85.6,45.42 83.11,42.93 73.3,42.93 71.15,45.09 71.15,47.62 71.7,48.18 72.82,48.18 73.46,48.82 73.46,52.43 74.73,53.7 79.93,53.7 81.28,55.04 TB1.1
X_DIR
  Bottom 0.635: DIR1.2 76.49,58.42 66.04,58.42 TB1.8
X_STEP
  Top 0.635: TB1.5 71.12,61.26 STEP.1
Y_DIR
  Bottom 0.635: DIR2.1 72.48,59.56 64.74,59.56 61.06,55.88 TB1.9
Y_STEP
  Top 0.635: TB1.6 68.58,58.8 STEP.2
Z_DIR
  Bottom 0.635: DIR2.2 68.62,60.71 63.35,60.71 58.52,55.88 TB1.10
Z_STEP
  Top 0.635: TB1.7 66.04,57.36 58.63,64.77 STEP.3

### Text on the board
tNames: VSEL | IN | GND | VSEL | IN | GND | VSEL | IN | GND | Z | Y | X | Z | Y | X | EN | Z-LIMIT (IN3) | Y-LIMIT (IN2) | X-LIMIT (IN1) | STEP/PUL | DIR | G | 12V | 5V | GND | LIMIT SW VSEL | DRV BRD | VSEL | 12V | USB | CNC OMNIBUS | GRBL Edition - REV 1 | NEG | Spindle Relais | R1 | SHIELD | 12V | 5V | GND | TX | RX | SPINDLE | COOLANT | REL/COOL VSEL | VSEL | BLUETOOTH | 5V FOR / ARDUINO | 5V | PWR | NEG | COOLANT | GND | RST | RST | SHIELD | 12V | POWER | GND | 5V PWM | VFD RUN | VFD RPM | ABORT | HOLD | RESUME | PROBE | GND | PWM | DCOM | FOR | 0-10V | GND | IN | GND | IN | GND | IN | GND | IN | GND
bNames: By Albert Kravcov